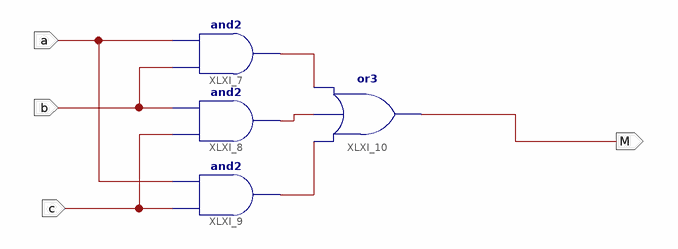
[diagram p0: schematic sheet 1]
// Xilinx ISE schematic TP23.sch (spartan3e) as structural Verilog: 4 symbols, 4 ports
module TP23 (
  input  a,
  input  b,
  input  c,
  output M
);

  wire XLXN_21, XLXN_22, XLXN_23;

  and XLXI_7 (XLXN_23, b, a);
  and XLXI_8 (XLXN_21, c, b);
  and XLXI_9 (XLXN_22, c, a);
  or XLXI_10 (M, XLXN_22, XLXN_21, XLXN_23);
endmodule
